# EAGLE design Solid Sequencer (EAGLE 6.3)
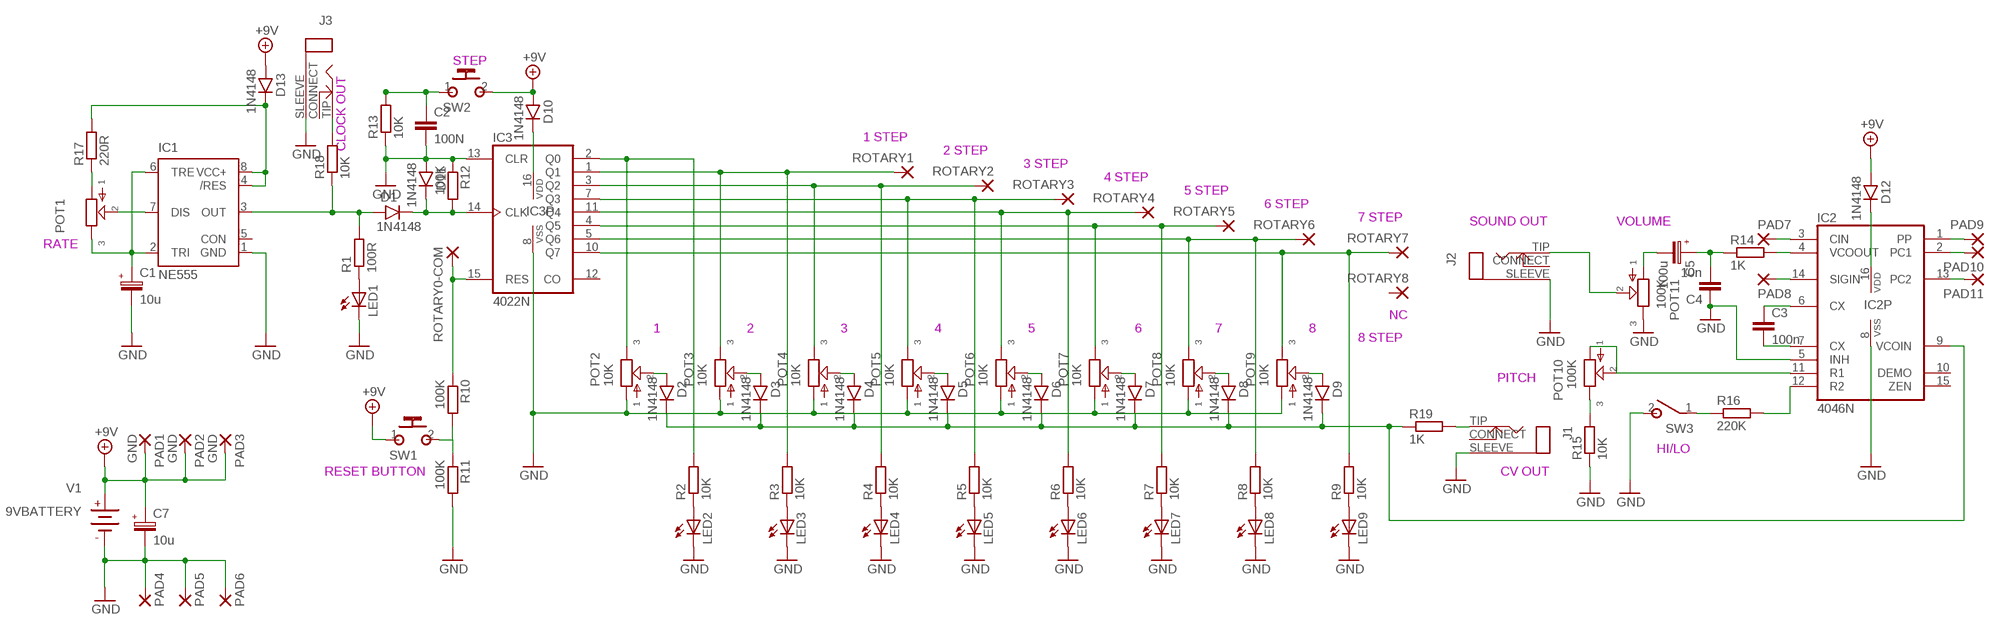
[diagram p0: schematic, sheet 1]

## Parts
C1  10u  050-EU  [050_020]
C2  100N  075X0303  [075X030_3]
C3  100n  075X0302  [075X030]
C4  10n  075X0302  [075X030]
C5  100u  050-EU1  [050_020_1]
C7  10u  050-EU1  [050_020_1]
D1  1N4148  1N914.3  [DO35-3]
D2  1N4148  1N914.3  [DO35-3]
D3  1N4148  1N914.3  [DO35-3]
D4  1N4148  1N914.3  [DO35-3]
D5  1N4148  1N914.3  [DO35-3]
D6  1N4148  1N914.3  [DO35-3]
D7  1N4148  1N914.3  [DO35-3]
D8  1N4148  1N914.3  [DO35-3]
D9  1N4148  1N914.3  [DO35-3]
D10  1N4148  1N914.3  [DO35-3]
D11  1N4148  1N914.3  [DO35-3]
D12  1N4148  1N914.3  [DO35-3]
D13  1N4148  1N914.3  [DO35-3]
IC1  NE555  [DIL-08]
IC2  4046N  [DIL16]
IC3  4022N  [DIL16]
J1  CLOSEDMONO  [CLOSED_MONO_JACK]
J2  CLOSEDMONO  [CLOSED_MONO_JACK]
J3  CLOSEDMONO  [CLOSED_MONO_JACK]
LED1  LED3MM  [LED3MM]
LED2  LED3MM  [LED3MM]
LED3  LED3MM  [LED3MM]
LED4  LED3MM  [LED3MM]
LED5  LED3MM  [LED3MM]
LED6  LED3MM  [LED3MM]
LED7  LED3MM  [LED3MM]
LED8  LED3MM  [LED3MM]
LED9  LED3MM  [LED3MM]
PAD1  GND  2,15/1,0  [2,15/1,0]
PAD2  GND  2,15/1,0  [2,15/1,0]
PAD3  GND  2,15/1,0  [2,15/1,0]
PAD4  2,15/1,0  [2,15/1,0]
PAD5  2,15/1,0  [2,15/1,0]
PAD6  2,15/1,0  [2,15/1,0]
PAD7  2,15/1,0  [2,15/1,0]
PAD8  2,15/1,0  [2,15/1,0]
PAD9  2,15/1,0  [2,15/1,0]
PAD10  2,15/1,0  [2,15/1,0]
PAD11  2,15/1,0  [2,15/1,0]
POT1  POT-EU  [POT]
POT2  10K  POT-EU  [POT]
POT3  10K  POT-EU  [POT]
POT4  10K  POT-EU  [POT]
POT5  10K  POT-EU  [POT]
POT6  10K  POT-EU  [POT]
POT7  10K  POT-EU  [POT]
POT8  10K  POT-EU  [POT]
POT9  10K  POT-EU  [POT]
POT10  100K  POT-EU  [POT]
POT11  100K  POT-EU  [POT]
R1  100R  R-EU_0207/7  [0207/7]
R2  10K  R-EU_0207/7  [0207/7]
R3  10K  R-EU_0207/7  [0207/7]
R4  10K  R-EU_0207/7  [0207/7]
R5  10K  R-EU_0207/7  [0207/7]
R6  10K  R-EU_0207/7  [0207/7]
R7  10K  R-EU_0207/7  [0207/7]
R8  10K  R-EU_0207/7  [0207/7]
R9  10K  R-EU_0207/7  [0207/7]
R10  100K  R-EU_0207/7  [0207/7]
R11  100K  R-EU_0207/7  [0207/7]
R12  100K  R-EU_0207/7  [0207/7]
R13  10K  R-EU_0207/7  [0207/7]
R14  1K  R-EU_0207/7  [0207/7]
R15  10K  R-EU_0207/7  [0207/7]
R16  220K  R-EU_0207/7  [0207/7]
R17  220R  R-EU_0207/7  [0207/7]
R18  10K  R-EU_0207/7  [0207/7]
R19  1K  R-EU_0207/7  [0207/7]
ROTARY0-COM  2,15/1,0  [2,15/1,0]
ROTARY1  2,15/1,0  [2,15/1,0]
ROTARY2  2,15/1,0  [2,15/1,0]
ROTARY3  2,15/1,0  [2,15/1,0]
ROTARY4  2,15/1,0  [2,15/1,0]
ROTARY5  2,15/1,0  [2,15/1,0]
ROTARY6  2,15/1,0  [2,15/1,0]
ROTARY7  2,15/1,0  [2,15/1,0]
ROTARY8  2,15/1,0  [2,15/1,0]
SW1  MOMENTARY  [SPST]
SW2  MOMENTARY  [SPST]
SW3  SPST  [SPST]
V1  9VBATTERY  [AB9V]

## Nets
+9V: C7.+ D10.A D12.A D13.A PAD1.1(P) PAD2.1(P) PAD3.1(P) SW1.1(P) SW2.2(S) V1.+
GND: C1.- C2.2 C4.1 C7.- D11.A IC1.1(GND) IC2.5(INH) IC2.8(VSS) IC3.8(VSS) IC3.13(CLR) J1.SLEEVE(RING) J2.SLEEVE(RING) J3.SLEEVE(RING) LED1.K(C) LED2.K(C) LED3.K(C) LED4.K(C) LED5.K(C) LED6.K(C) LED7.K(C) LED8.K(C) LED9.K(C) PAD4.1(P) PAD5.1(P) PAD6.1(P) POT2.1 POT3.1 POT4.1 POT5.1 POT6.1 POT7.1 POT8.1 POT9.1 POT11.3 R11.2 R12.1 R13.1 R15.1 SW3.2(S) V1.-
N$1: IC1.7(DIS) POT1.2
N$2: C1.+ IC1.2(TRI) IC1.6(TRE) POT1.3
N$3: J3.TIP R18.2
N$4: LED1.A R1.1
N$5: J1.TIP R19.2
N$6: IC3.2(Q0) POT2.3 R2.2
N$7: D1.C D11.C IC3.14(CLK) R12.2
N$8: D2.A POT2.2
N$9: D2.C D3.C D4.C D5.C D6.C D7.C D8.C D9.C IC2.9(VCOIN) R19.1
N$10: LED2.A R2.1
N$11: IC3.1(Q1) POT3.3 R3.2 ROTARY1.1(P)
N$12: D3.A POT3.2
N$13: D10.C IC3.16(VDD)
N$14: LED3.A R3.1
N$15: IC3.3(Q2) POT4.3 R4.2 ROTARY2.1(P)
N$16: D4.A POT4.2
N$17: IC2.11(R1) POT10.1 POT10.2
N$18: LED4.A R4.1
N$19: IC3.7(Q3) POT5.3 R5.2 ROTARY3.1(P)
N$20: D5.A POT5.2
N$21: R10.2 R11.1 SW1.2(S)
N$22: LED5.A R5.1
N$23: IC3.11(Q4) POT6.3 R6.2 ROTARY4.1(P)
N$24: D6.A POT6.2
N$25: C2.1 R13.2 SW2.1(P)
N$26: LED6.A R6.1
N$27: IC3.15(RES) R10.1 ROTARY0-COM.1(P)
N$28: D7.A POT7.2
N$29: D1.A IC1.3(OUT) R1.2 R18.1
N$30: LED7.A R7.1
N$31: IC3.5(Q6) POT8.3 R8.2 ROTARY6.1(P)
N$32: D8.A POT8.2
N$34: LED8.A R8.1
N$35: IC3.10(Q7) POT9.3 R9.2 ROTARY7.1(P)
N$36: D9.A POT9.2
N$37: D12.C IC2.16(VDD)
N$38: LED9.A R9.1
N$39: IC2.3(CIN) PAD7.1(P)
N$40: C3.1 IC2.6(CX)
N$41: C3.2 IC2.7(CX)
N$42: IC2.12(R2) R16.2
N$43: POT10.3 R15.2
N$44: IC2.14(SIGIN) PAD8.1(P)
N$45: IC2.4(VCOOUT) R14.2
N$46: C4.2 C5.+ R14.1
N$47: C5.- POT11.1
N$48: R16.1 SW3.1(P)
N$49: IC2.1(PP) PAD9.1(P)
N$50: IC2.2(PC1) PAD10.1(P)
N$51: IC2.13(PC2) PAD11.1(P)
N$52: IC3.4(Q5) POT7.3 R7.2 ROTARY5.1(P)
N$53: POT1.1 R17.1
N$54: D13.C IC1.4(/RES) IC1.8(VCC+) R17.2
N$55: J2.TIP POT11.2
Unconnected: IC1.5(CON) IC2.10(DEMO) IC2.15(ZEN) IC3.12(CO) J1.CONNECT J2.CONNECT J3.CONNECT ROTARY8.1(P)

## Notes on the sheet
- STEP
- CLOCK OUT
- 1 STEP
- 2 STEP
- 3 STEP
- 4 STEP
- 5 STEP
- 6 STEP
- 7 STEP
- SOUND OUT | VOLUME
- RATE
- NC
- 1 | 2 | 3 | 4 | 5 | 6 | 7 | 8 | 8 STEP
- PITCH
- HI/LO
- RESET BUTTON | CV OUT

## Library data of the parts
C1 C5 C7 = gm-caps-electro-pol:050-EU
C2-C4 = gm-caps-film-chicklet:075X030: 0.015 - 0.022uF Panasonic ECQ-B 7.5mm x 3mm 50 or 63V: 0.015 - 0.022uF;
D1-D13 = gm-diodes:1N914: Fast Switching Diode DO-35 glass case a.k.a. 1N4148
IC1 = st-microelectronics:NE555: General purpose bipolar Timer; MF: Arrow Electronics; MPN: NE555N; OC_FARNELL: 1467742; OC_NEWARK: 89K1486
IC2 = 40xx:4046: Micropower PLL
IC3 = 40xx:4022: Divide-by 8 COUNTER
J1-J3 = gm-jacks:CLOSEDMONO: Closed Mono 1/4" Phone Jack
LED1-LED9 = led:LED: LED OSRAM: - CHIPLED LG R971, LG N971, LY N971, LG Q971, LY Q971, LO R971, LY R971 LH N974, LH R974 LS Q976, LO Q976, LY Q976 LO Q996 - Hyper CHIPLED LW Q18S LB Q993, LB Q99A, LB R99A - SideLED LS A670, LO A670, LY A670, LG A670, LP A670 LB A673, LV A673, LT A673, LW A673 LH A674 LY A675 LS A676, LA A676, LO A676, LY A676, LW A676 LS A679, LY A679, LG A679 - Hyper Micro SIDELED® LS Y876, LA Y876, LO Y876, LY Y876 LT Y87S - SmartLED LW L88C, LW L88S LB L89C, LB L89S, LG L890 LS L89K, LO L89K, LY L89K LS L896, LA L896, LO L896, LY L896 - TOPLED LS T670, LO T670, LY T670, LG T670, LP T670 LSG T670, LSP T670, LSY T670, LOP T670, LYG T670 LG T671, LOG T671, LSG T671 LB T673, LV T673, LT T673, LW T673 LH T674 LS T676, LA T676, LO T676, LY T676, LB T676, LH T676, LSB T676, LW T676 LB T67C, LV T67C, LT T67C, LS T67K, LO T67K, LY T67K, LW E67C LS E67B, LA E67B, LO E67B, LY E67B, LB E67C, LV E67C, LT E67C LW T67C LS T679, LY T679, LG T679 LS T770, LO T770, LY T770, LG T770, LP T770 LB T773, LV T773, LT T773, LW T773 LH T774 LS E675, LA E675, LY E675, LS T675 LS T776, LA T776, LO T776, LY T776, LB T776 LHGB T686 LT T68C, LB T68C - Hyper Mini TOPLED® LB M676 - Mini TOPLED Santana® LG M470 LS M47K, LO M47K, LY M47K Source: http://www.osram.convergy.de LUXEON: - LUMILED® LXK2-PW12-R00, LXK2-PW12-S00, LXK2-PW14-U00, LXK2-PW14-V00 LXK2-PM12-R00, LXK2-PM12-S00, LXK2-PM14-U00 LXK2-PE12-Q00, LXK2-PE12-R00, LXK2-PE12-S00, LXK2-PE14-T00, LXK2-PE14-U00 LXK2-PB12-K00, LXK2-PB12-L00, LXK2-PB12-M00, LXK2-PB14-N00, LXK2-PB14-P00, LXK2-PB14-Q00 LXK2-PR12-L00, LXK2-PR12-M00, LXK2-PR14-Q00, LXK2-PR14-R00 LXK2-PD12-Q00, LXK2-PD12-R00, LXK2-PD12-S00 LXK2-PH12-R00, LXK2-PH12-S00 LXK2-PL12-P00, LXK2-PL12-Q00, LXK2-PL12-R00 Source: www.luxeon.com KINGBRIGHT: KA-3528ASYC Source: www.kingbright.com
PAD1-PAD11 ROTARY0-COM ROTARY1-ROTARY8 = wirepad:2,15/1,0: THROUGH-HOLE PAD
POT1-POT11 = gm-pots:POT-EU
R1-R19 = rcl:R-EU_: RESISTOR, European symbol
SW1 SW2 = gm-switches:MOMENTARY
SW3 = gm-switches:SPST
V1 = gm-supply:9VBATTERY

## Board
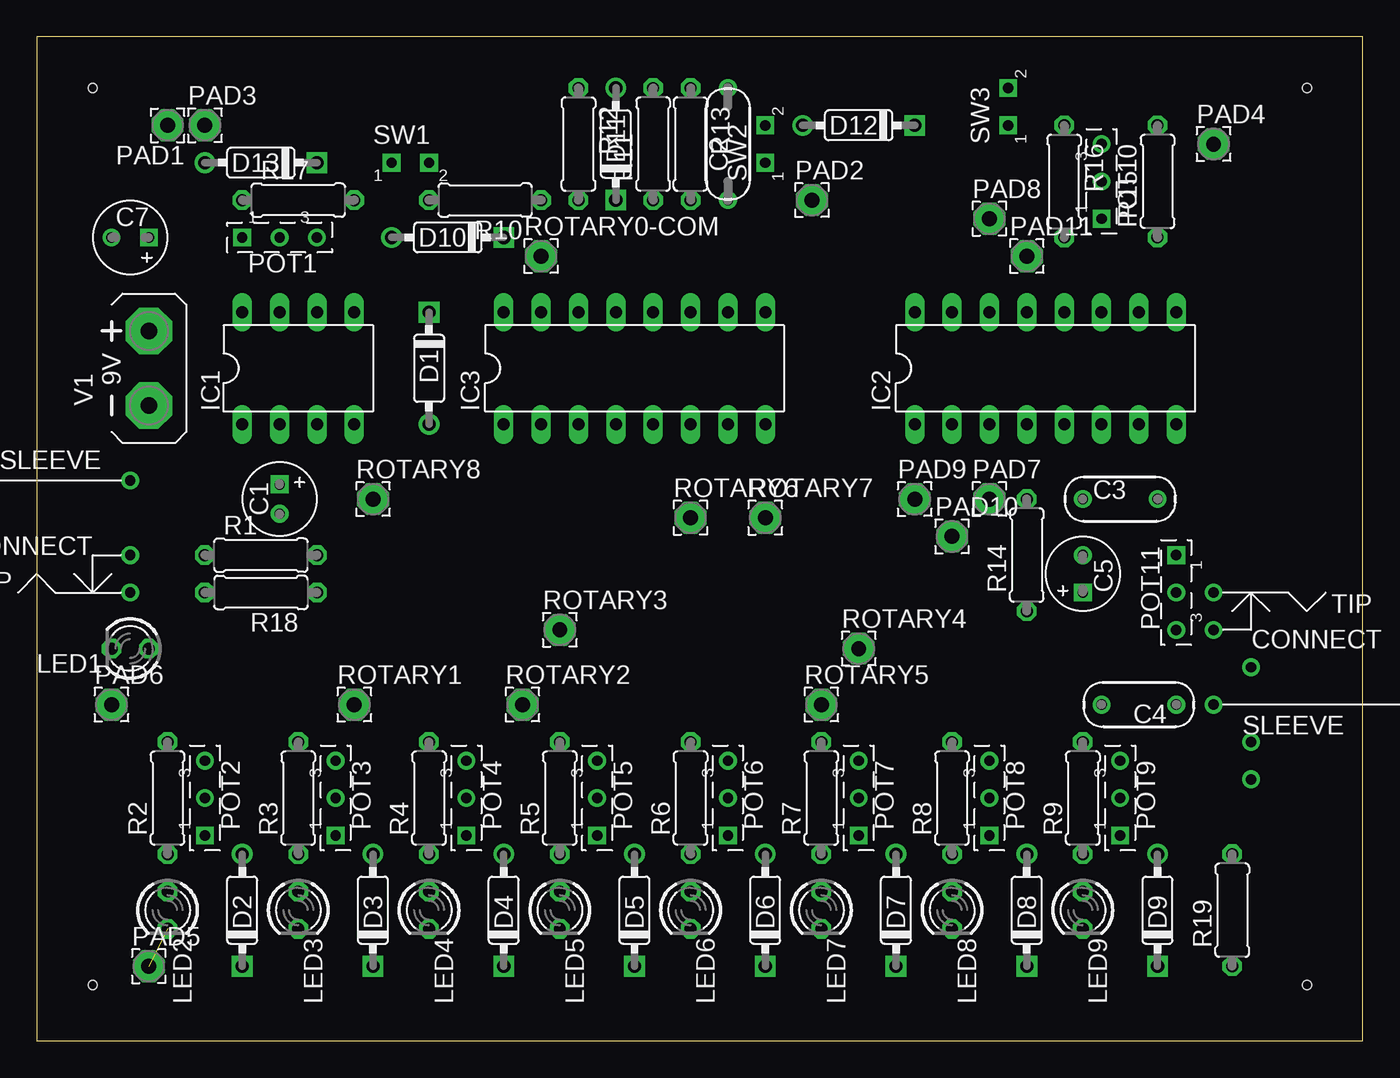
[diagram p1: board, top side]
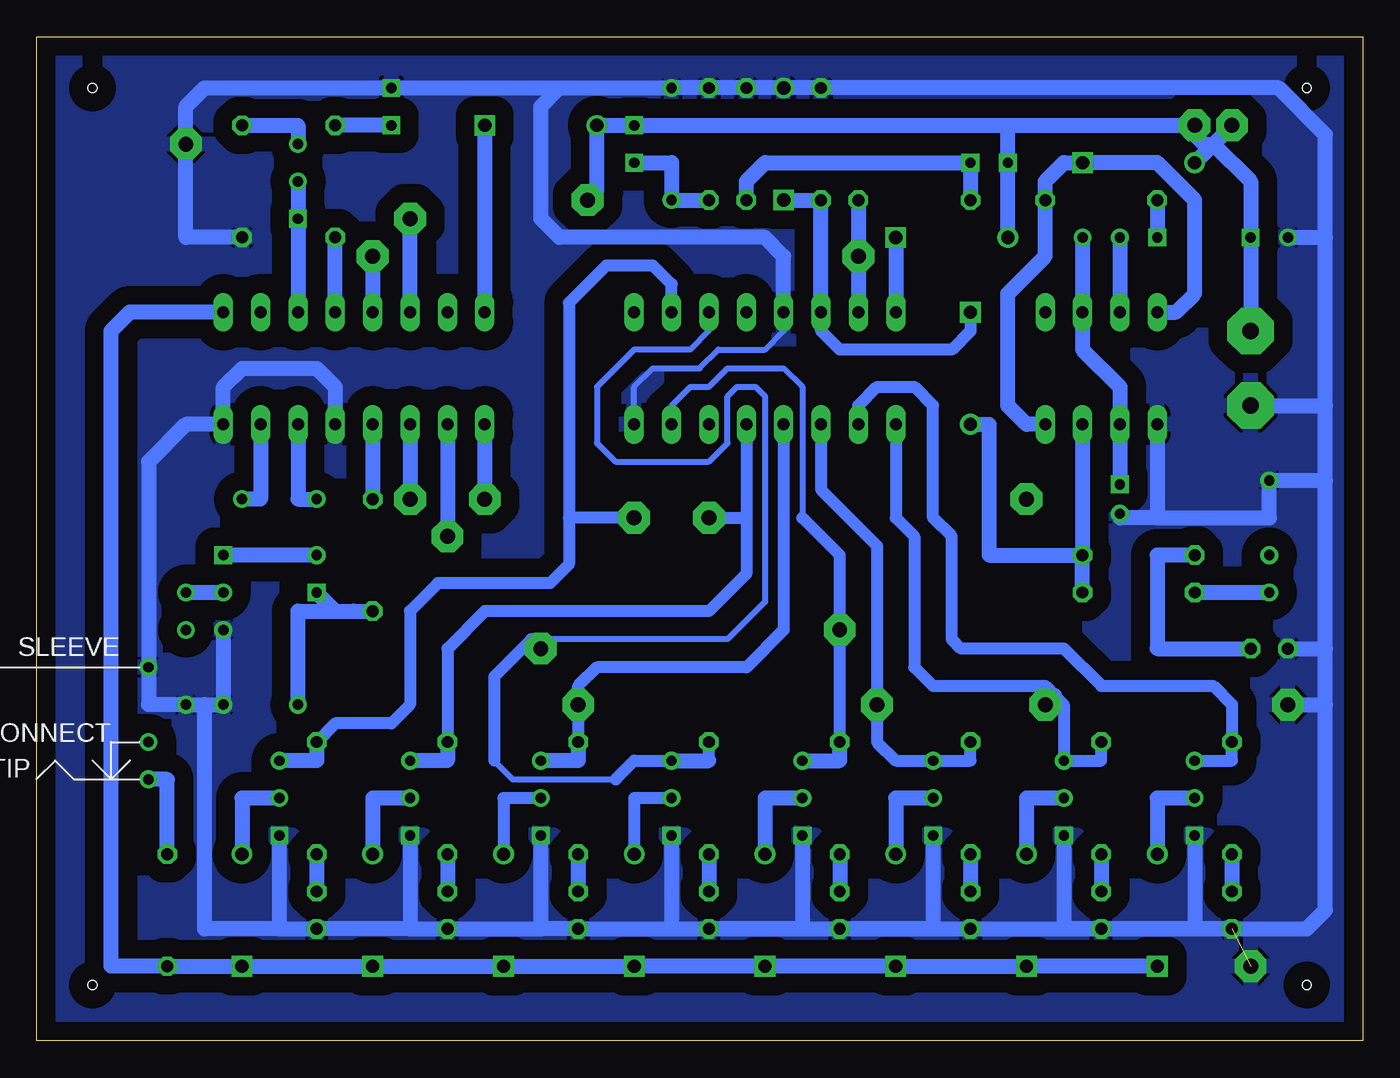
[diagram p2: board, bottom side, seen from below]

Size 90.15 x 68.25 mm. Coordinates in mm from the lower left corner, seen from the top.
Outline: 0,0 90.15,0 90.15,68.25 0,68.25 0,0
Copper layers (1*16): Top 0.035mm / dielectric 1.5mm / Bottom 0.035mm
Design rules "default *": minimum track width 10mil, minimum drill 24mil, track to track 8mil, track to pad 8mil, pad to pad 8mil, via to via 8mil, smd to smd 8mil, copper to edge 40mil, drill to drill 8mil, minimum pad ring 10mil, minimum via ring 8mil, stop-mask expansion 4mil, vias tented up to drill 0mil, thermal gap 10mil
Holes 0.6 mm at 3.81,3.81 86.36,3.81 86.36,64.77 3.81,64.77

### Footprints (pad centres in the part's own frame; a part is rotated, then mirrored left to right if it is on the bottom)
050_020 = drill 0.7 square: + -1,0 | drill 0.7: - 1,0
075X030_3 = drill 0.7: 1 -3.81,0; 2 3.81,0
075X030 = drill 0.7: 1 -2.54,0; 2 2.54,0
050_020_1 = drill 0.7 square: + -1.27,0 | drill 0.7: - 1.27,0
DO35-3 = drill 0.9: A 3.81,0 | drill 0.9 square: C -3.81,0
DIL-08 = drill 0.813 long: 1 -3.81,-3.81; 2 -1.27,-3.81; 3 1.27,-3.81; 4 3.81,-3.81; 5 3.81,3.81; 6 1.27,3.81; 7 -1.27,3.81; 8 -3.81,3.81
DIL16 = drill 0.813 long: 1 -8.89,-3.81; 2 -6.35,-3.81; 3 -3.81,-3.81; 4 -1.27,-3.81; 5 1.27,-3.81; 6 3.81,-3.81; 7 6.35,-3.81; 8 8.89,-3.81; 9 8.89,3.81; 10 6.35,3.81; 11 3.81,3.81; 12 1.27,3.81; 13 -1.27,3.81; 14 -3.81,3.81; 15 -6.35,3.81; 16 -8.89,3.81
CLOSED_MONO_JACK = drill 0.7: CONNECT 7.62,-1.27; SLEEVE 7.62,3.81; TIP 7.62,-3.81
LED3MM = drill 0.813 octagon: A -1.27,0; K 1.27,0
2,15/1,0 = drill 1.016 pad 2.159 octagon: 1 0,0
POT = drill 0.7 square: 1 2.54,0 | drill 0.7: 2 0,0; 3 -2.54,0
0207/7 = drill 0.813 octagon: 1 -3.81,0; 2 3.81,0
SPST = drill 0.7 square: 1 -1.27,0; 2 1.27,0
AB9V = drill 1.118 pad 3.15 octagon: + 0,2.54; - 0,-2.54

### Placement (x,y rotation side)
C1  16.51,36.83 270 top
C2  46.99,60.96 90 top
C3  73.66,36.83 0 top
C4  74.93,22.86 180 top
C5  71.12,31.75 90 top
C7  6.35,54.61 180 top
D1  26.67,45.72 270 top
D2  13.97,8.89 90 top
D3  22.86,8.89 90 top
D4  31.75,8.89 90 top
D5  40.64,8.89 90 top
D6  49.53,8.89 90 top
D7  58.42,8.89 90 top
D8  67.31,8.89 90 top
D9  76.2,8.89 90 top
D10  27.94,54.61 180 top
D11  39.37,60.96 90 top
D12  55.88,62.23 180 top
D13  15.24,59.69 180 top
IC1  17.78,45.72 0 top
IC2  68.58,45.72 0 top
IC3  40.64,45.72 0 top
J1  90.17,21.59 0 bottom
J2  87.63,26.67 180 top
J3  -1.27,34.29 0 top
LED1  6.35,26.67 180 top
LED2  8.89,8.89 270 top
LED3  17.78,8.89 270 top
LED4  26.67,8.89 270 top
LED5  35.56,8.89 270 top
LED6  44.45,8.89 270 top
LED7  53.34,8.89 270 top
LED8  62.23,8.89 270 top
LED9  71.12,8.89 270 top
PAD1  8.89,62.23 180 top
PAD2  52.7,57.15 0 top
PAD3  11.43,62.23 0 top
PAD4  80.01,60.96 0 top
PAD5  7.62,5.08 0 top
PAD6  5.08,22.86 0 top
PAD7  64.77,36.83 0 top
PAD8  64.77,55.88 0 top
PAD9  59.69,36.83 0 top
PAD10  62.23,34.29 0 top
PAD11  67.31,53.34 0 top
POT1  16.51,54.61 180 top
POT2  11.43,16.51 270 top
POT3  20.32,16.51 270 top
POT4  29.21,16.51 270 top
POT5  38.1,16.51 270 top
POT6  46.99,16.51 270 top
POT7  55.88,16.51 270 top
POT8  64.77,16.51 270 top
POT9  73.66,16.51 270 top
POT10  72.39,58.42 270 top
POT11  77.47,30.48 90 top
R1  15.24,33.02 0 top
R2  8.89,16.51 90 top
R3  17.78,16.51 90 top
R4  26.67,16.51 90 top
R5  35.56,16.51 90 top
R6  44.45,16.51 90 top
R7  53.34,16.51 90 top
R8  62.23,16.51 90 top
R9  71.12,16.51 90 top
R10  30.48,57.15 180 top
R11  41.91,60.96 90 top
R12  36.83,60.96 270 top
R13  44.45,60.96 270 top
R14  67.31,33.02 90 top
R15  76.2,58.42 90 top
R16  69.85,58.42 270 top
R17  17.78,57.15 0 top
R18  15.24,30.48 180 top
R19  81.28,8.89 90 top
ROTARY0-COM  34.29,53.34 0 top
ROTARY1  21.59,22.86 0 top
ROTARY2  33.02,22.86 0 top
ROTARY3  35.56,27.94 0 top
ROTARY4  55.88,26.67 0 top
ROTARY5  53.34,22.86 0 top
ROTARY6  44.45,35.56 0 top
ROTARY7  49.53,35.56 0 top
ROTARY8  22.86,36.83 0 top
SW1  25.4,59.69 0 top
SW2  49.53,60.96 90 top
SW3  66.04,63.5 90 top
V1  7.62,45.72 0 top

### Tracks (layer width: path | path; a pad name or v marks a point on that pad's centre or on a via)
+9V
  Bottom 1.016: V1.+ C7.+ 7.62,58.42 10.16,60.96 | PAD2.1 52.07,57.78 D12.A SW2.2 24.13,62.23 | D10.A SW1.1 24.13,62.23 | 24.13,62.23 12.06,62.23 | D13.A 10.16,60.96 | PAD1.1 10.16,60.96 | 12.06,62.23 10.79,60.96 10.16,60.96 | PAD3.1 12.06,62.23
GND  (1 unrouted)
  Bottom 0.406: IC3.8 49.53,44.45 48.26,45.72 45.09,45.72 43.81,46.99 40.64,46.99 39.37,48.26 IC3.13
  Bottom 1.016: 20.32,7.62 LED3.K 11.43,7.62 | POT3.1 20.32,7.62 | POT4.1 29.21,7.62 | 29.21,7.62 LED4.K 20.32,7.62 | LED2.K 11.43,7.62 | POT2.1 11.43,7.62 | POT5.1 38.1,7.62 | 38.1,7.62 LED5.K 29.21,7.62 | 38.1,7.62 LED6.K | 46.99,7.62 LED6.K | 46.99,7.62 LED7.K 55.88,7.62 | 55.88,7.62 POT7.1 | 55.88,7.62 LED8.K 64.77,7.62 | POT9.1 73.66,7.62 | 73.66,7.62 LED9.K 64.77,7.62 | POT8.1 64.77,7.62 | IC3.13 39.37,53.34 40.64,54.61 54.61,54.61 55.88,55.88 55.88,63.5 54.61,64.77 | 54.61,64.77 C2.2 R13.1 R11.2 D11.A R12.1 5.71,64.77 2.54,61.59 2.54,54.61 | POT6.1 46.99,7.62 | LED6.K LED2.K | 2.54,38.1 2.54,43.18 | 2.54,43.18 2.54,54.61 | 54.61,64.77 SW3.2 78.74,64.77 80.01,63.5 PAD4.1 80.01,54.61 R15.1 | 2.54,38.1 J3.SLEEVE 6.35,35.56 13.97,35.56 | LED2.K 3.81,7.62 2.54,8.89 2.54,22.86 | 2.54,22.86 2.54,26.67 | 2.54,26.67 2.54,38.1 | PAD6.1 2.54,22.86 | C7.- 2.54,54.61 | C1.- 16.51,35.56 13.97,35.56 | V1.- 2.54,43.18 | IC1.1 13.97,35.56 | IC2.5 69.85,44.45 71.12,45.72 76.2,45.72 77.47,44.45 IC2.8 80.01,41.91 82.55,39.37 J1.SLEEVE 82.55,22.86 J2.SLEEVE 78.74,22.86 | POT11.3 C4.1 78.74,22.86 | LED1.K 2.54,26.67 | 73.66,7.62 78.74,7.62 78.74,22.86
  pour Bottom (isolate 1.27): 1.27,67.31 88.9,67.31 88.9,1.27 1.27,1.27
N$1
  Bottom 1.016: POT1.2 IC1.7
N$2
  Bottom 1.016: C1.+ IC1.2 16.51,44.45 19.05,46.99 IC1.6 POT1.3
N$3
  Bottom 1.016: J3.TIP R18.2
N$4
  Bottom 1.016: R1.1 13.97,33.02 13.97,26.67 LED1.A
N$5
  Bottom 1.016: R19.2 81.28,17.78 J1.TIP
N$6
  Bottom 0.813: IC3.2 34.29,43.18 33.02,44.45 30.48,44.45 29.21,43.18 29.21,35.56 27.94,34.29 27.94,27.3 27.3,26.67 20.32,26.67 17.78,24.13 10.16,24.13 8.89,22.86 R2.2 8.89,19.05 POT2.3
N$7
  Bottom 0.813: IC3.14 36.83,48.26 35.56,46.99 27.94,46.99 26.67,48.26 D1.C
  Bottom 1.016: D11.C R12.2 IC3.14
N$8
  Bottom 1.016: POT2.2 13.97,16.51 D2.A
N$9
  Bottom 1.016: D2.C D3.C D4.C D5.C D6.C D7.C D8.C D9.C R19.1 85.09,5.08 85.09,48.26 83.82,49.53 IC2.9
N$10
  Bottom 1.016: R2.1 LED2.A
N$11
  Bottom 0.813: R3.2 17.78,19.05 POT3.3 20.32,22.86 20.95,23.5 21.59,24.13 29.21,24.13 30.48,25.4 30.48,34.29 31.75,35.56 IC3.1
  Bottom 1.016: ROTARY1.1 20.95,23.5
N$12
  Bottom 1.016: POT3.2 22.86,16.51 D3.A
N$13
  Bottom 1.016: D10.C IC3.16
N$14
  Bottom 1.016: R3.1 LED3.A
N$15
  Bottom 0.813: IC3.3 36.83,37.47 33.02,33.66 ROTARY2.1 33.02,20.32 31.75,19.05 POT4.3 26.67,19.05 R4.2
N$16
  Bottom 1.016: POT4.2 31.75,16.51 D4.A
N$17
  Bottom 1.016: POT10.2 POT10.1 IC2.11
N$18
  Bottom 1.016: R4.1 LED4.A
N$19
  Bottom 0.406: 38.1,35.56 38.1,44.45 39.37,45.72 43.18,45.72 44.45,44.45 45.72,44.45 46.99,43.18 IC3.7
  Bottom 0.813: R5.2 ROTARY3.1 35.56,33.02 38.1,35.56
  Bottom 1.016: POT5.3 35.56,19.05 R5.2
N$20
  Bottom 1.016: POT5.2 40.64,16.51 D5.A
N$21
  Bottom 1.016: R10.2 SW1.2 40.64,59.69 41.91,58.42 R11.1
N$22
  Bottom 1.016: R5.1 LED5.A
N$23
  Bottom 0.406: IC3.11 44.45,48.26 45.72,46.99 49.53,46.99 52.07,44.45 52.07,40.64 50.8,39.37 44.45,39.37 43.18,40.64 43.18,43.81 42.55,44.45 41.27,44.45 40.64,43.81 40.64,29.84 43.18,27.3 55.88,27.3 56.52,27.3 | 59.05,19.05 57.78,17.78 50.8,17.78
  Bottom 0.813: 56.52,27.3 59.05,24.77 59.05,19.05 | 50.8,17.78 49.53,19.05 POT6.3 | ROTARY4.1 55.88,27.3 | 44.45,19.05 R6.2
  Bottom 1.016: POT6.3 44.45,19.05
N$24
  Bottom 0.813: POT6.2 49.53,16.51 D6.A
N$25
  Bottom 1.016: R13.2 C2.1 46.99,59.69 SW2.1
N$26
  Bottom 1.016: R6.1 LED6.A
N$27
  Bottom 1.016: R10.1 ROTARY0-COM.1 IC3.15
N$28
  Bottom 0.813: POT7.2 58.42,16.51 D7.A
N$29
  Bottom 1.016: IC1.3 R1.2 | D1.A 25.4,41.91 25.4,33.02 R1.2 | R18.1 R1.2
N$30
  Bottom 1.016: R7.1 LED7.A
N$31
  Bottom 0.813: IC3.5 41.91,35.56 | 41.91,35.56 41.91,31.75 44.45,29.21 59.69,29.21 62.23,26.67 R8.2 | ROTARY6.1 41.91,35.56
  Bottom 1.016: R8.2 62.23,19.05 POT8.3
N$32
  Bottom 1.016: POT8.2 67.31,16.51 D8.A
N$34
  Bottom 1.016: R8.1 LED8.A
N$35
  Bottom 0.813: IC3.10 46.99,51.44 48.26,52.7 51.44,52.7 53.98,50.16 53.98,35.56 | 53.98,35.56 53.98,32.38 55.24,31.11 62.87,31.11 64.77,29.21 64.77,22.86 66.04,21.59 69.85,21.59 R9.2 | ROTARY7.1 53.98,35.56
  Bottom 1.016: R9.2 71.12,19.05 POT9.3
N$36
  Bottom 1.016: POT9.2 76.2,16.51 D9.A
N$37
  Bottom 1.016: D12.C IC2.16
N$38
  Bottom 1.016: R9.1 LED9.A
N$39
  Bottom 1.016: IC2.3 PAD7.1
N$40
  Bottom 1.016: IC2.6 72.39,36.83 C3.1
N$41
  Bottom 1.016: IC2.7 74.93,36.83 C3.2
N$42
  Bottom 1.016: IC2.12 R16.2
N$43
  Bottom 1.016: R15.2 72.39,62.23 POT10.3
N$44
  Bottom 1.016: IC2.14 PAD8.1
N$45
  Bottom 1.016: IC2.4 R14.2
N$46
  Bottom 1.016: C5.+ 69.85,29.21 | 69.85,29.21 68.58,29.21 R14.1 | C4.2 72.39,29.21 69.85,29.21
N$47
  Bottom 1.016: C5.- POT11.1
N$48
  Bottom 1.016: SW3.1 R16.1
N$49
  Bottom 1.016: IC2.1 PAD9.1
N$50
  Bottom 1.016: IC2.2 PAD10.1
N$51
  Bottom 1.016: PAD11.1 IC2.13
N$52
  Bottom 0.813: IC3.4 39.37,27.94 41.91,25.4 52.07,25.4 53.34,24.13 ROTARY5.1 R7.2
  Bottom 1.016: R7.2 53.34,19.05 POT7.3
N$53
  Bottom 1.016: R17.1 POT1.1
N$54
  Bottom 1.016: IC1.4 22.86,41.91 24.13,43.18 24.13,50.8 21.59,53.34 R17.2 21.59,58.42 20.32,59.69 D13.C 13.97,59.69 11.43,57.15 11.43,50.8 12.7,49.53 IC1.8
N$55
  Bottom 1.016: POT11.2 J2.TIP